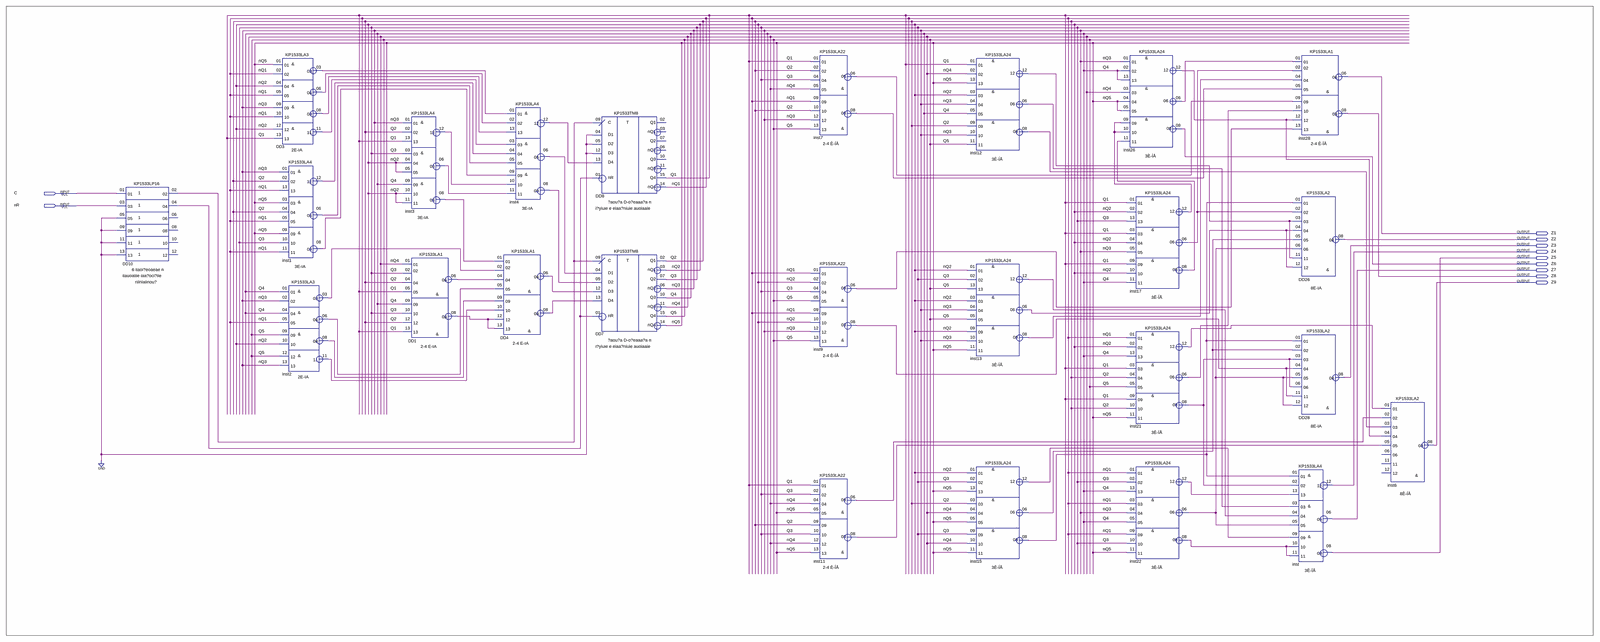
[diagram p0: schematic sheet, whole]
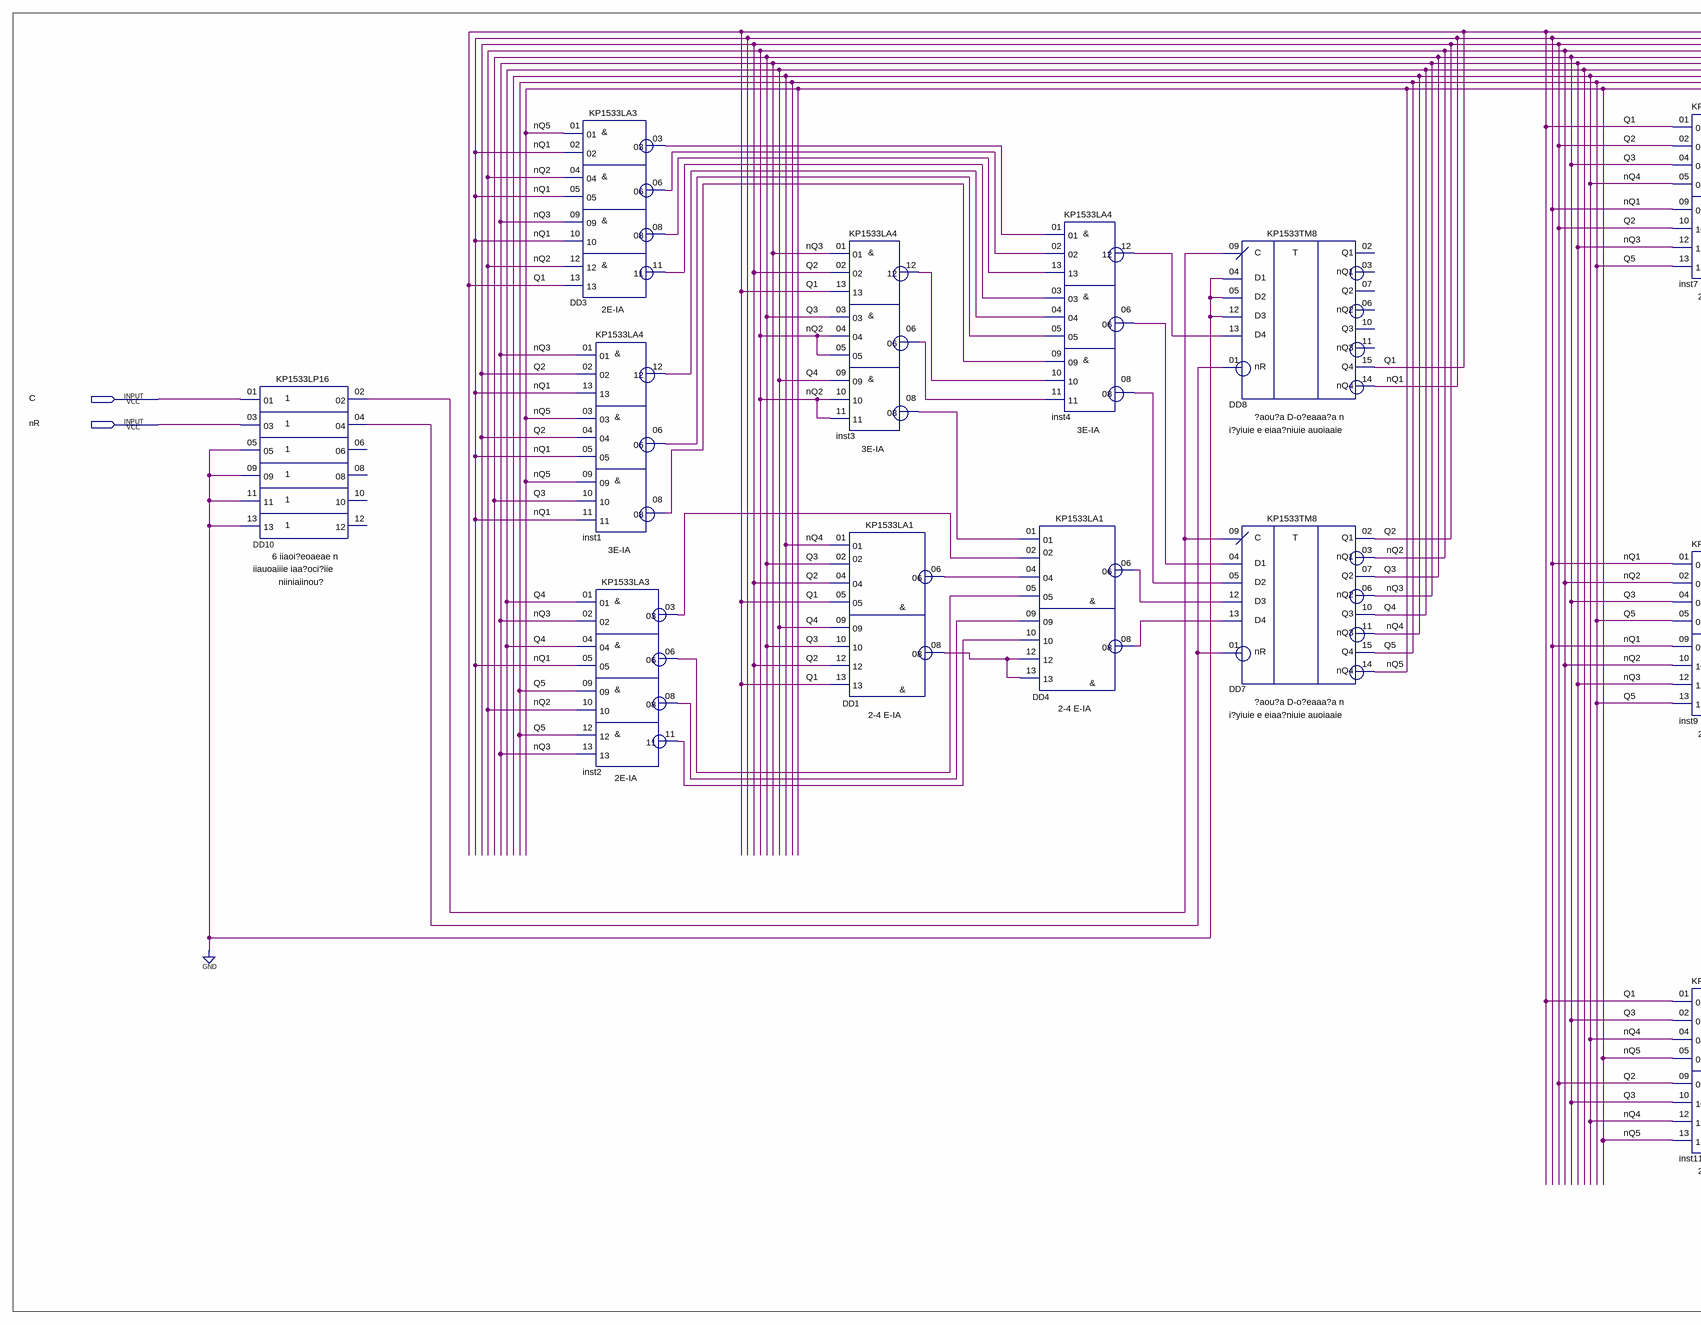
[diagram p1: schematic sheet, left part]
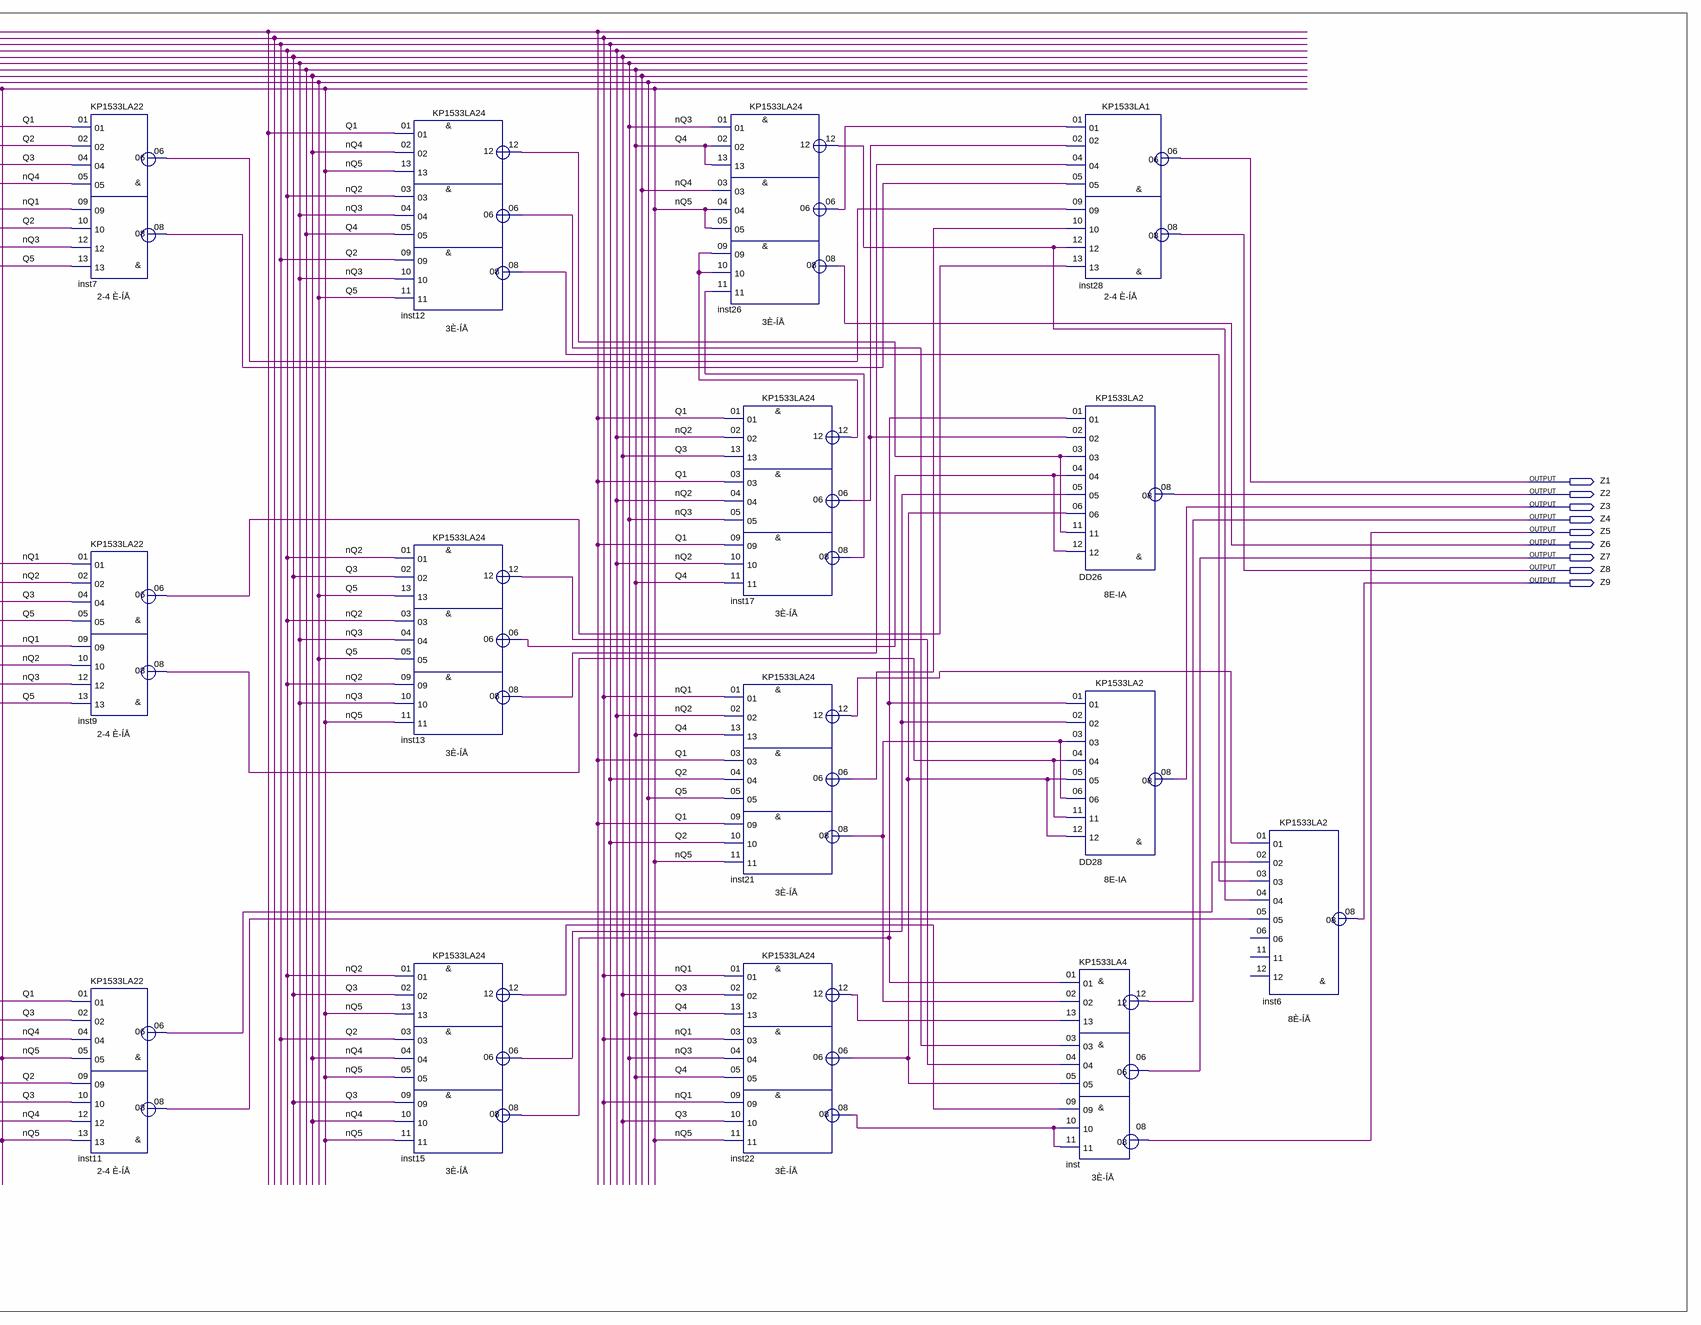
[diagram p2: schematic sheet, right part]
// Quartus schematic _GN_BC_DFF_PK_NAND.bdf as structural Verilog: 25 symbols, 11 pins
module _GN_BC_DFF_PK_NAND (
  input  C,
  input  nR,
  output Z1,
  output Z2,
  output Z3,
  output Z4,
  output Z5,
  output Z6,
  output Z7,
  output Z8,
  output Z9
);

  wire DD1_06, DD1_08, DD3_03, DD3_06, DD3_08, DD3_11, DD4_06, DD4_08, DD10_02, DD10_04, inst1_06, inst1_08,
       inst1_12, inst2_03, inst2_06, inst2_08, inst2_11, inst3_06, inst3_08, inst3_12, inst4_06, inst4_08,
       inst4_12, inst7_06, inst7_08, inst9_06, inst9_08, inst11_06, inst11_08, inst12_06, inst12_08,
       inst12_12, inst13_06, inst13_08, inst13_12, inst15_06, inst15_08, inst15_12, inst17_06, inst17_08,
       inst17_12, inst21_06, inst21_08, inst21_12, inst22_06, inst22_08, inst22_12, inst26_06, inst26_12,
       nQ1, nQ2, nQ3, nQ4, nQ5, Q1, Q2, Q3, Q4, Q5;

  KP1533LP16 DD10 (
    .\01 (C), .\03 (nR), .\05 (1'b0), .\09 (1'b0), .\11 (1'b0), .\13 (1'b0), .\02 (DD10_02), .\04 (DD10_04));  // open: 06, 08, 10, 12
  KP1533LA3 DD3 (
    .\01 (nQ5), .\02 (nQ1), .\04 (nQ2), .\05 (nQ1), .\09 (nQ3), .\10 (nQ1), .\12 (nQ2), .\13 (Q1),
    .\03 (DD3_03), .\06 (DD3_06), .\08 (DD3_08), .\11 (DD3_11));
  KP1533LA4 inst1 (
    .\01 (nQ3), .\02 (Q2), .\13 (nQ1), .\03 (nQ5), .\04 (Q2), .\05 (nQ1), .\09 (nQ5), .\10 (Q3), .\11 (nQ1),
    .\12 (inst1_12), .\06 (inst1_06), .\08 (inst1_08));
  KP1533LA3 inst2 (
    .\01 (Q4), .\02 (nQ3), .\04 (Q4), .\05 (nQ1), .\09 (Q5), .\10 (nQ2), .\12 (Q5), .\13 (nQ3),
    .\03 (inst2_03), .\06 (inst2_06), .\08 (inst2_08), .\11 (inst2_11));
  KP1533LA4 inst3 (
    .\01 (nQ3), .\02 (Q2), .\13 (Q1), .\03 (Q3), .\04 (nQ2), .\05 (nQ2), .\09 (Q4), .\10 (nQ2), .\11 (nQ2),
    .\12 (inst3_12), .\06 (inst3_06), .\08 (inst3_08));
  KP1533LA1 DD1 (
    .\01 (nQ4), .\02 (Q3), .\04 (Q2), .\05 (Q1), .\09 (Q4), .\10 (Q3), .\12 (Q2), .\13 (Q1), .\06 (DD1_06),
    .\08 (DD1_08));
  KP1533LA4 inst4 (
    .\01 (DD3_03), .\02 (DD3_06), .\13 (DD3_08), .\03 (DD3_11), .\04 (inst1_12), .\05 (inst1_06),
    .\09 (inst1_08), .\10 (inst3_12), .\11 (inst3_06), .\12 (inst4_12), .\06 (inst4_06), .\08 (inst4_08));
  KP1533LA1 DD4 (
    .\01 (inst3_08), .\02 (inst2_03), .\04 (DD1_06), .\05 (inst2_06), .\09 (inst2_08), .\10 (inst2_11),
    .\12 (DD1_08), .\13 (DD1_08), .\06 (DD4_06), .\08 (DD4_08));
  KP1533TM8 DD8 (
    .nR(DD10_04), .C(DD10_02), .D1(1'b0), .D2(1'b0), .D3(1'b0), .D4(inst4_12), .Q4(Q1), .nQ4(nQ1));  // open: Q1, nQ1, Q2, nQ2, Q3, nQ3
  KP1533TM8 DD7 (
    .nR(DD10_04), .C(DD10_02), .D1(inst4_06), .D2(inst4_08), .D3(DD4_06), .D4(DD4_08), .Q1(Q2), .nQ1(nQ2),
    .Q2(Q3), .nQ2(nQ3), .Q3(Q4), .nQ3(nQ4), .Q4(Q5), .nQ4(nQ5));
  KP1533LA22 inst7 (
    .\01 (Q1), .\02 (Q2), .\04 (Q3), .\05 (nQ4), .\09 (nQ1), .\10 (Q2), .\12 (nQ3), .\13 (Q5),
    .\06 (inst7_06), .\08 (inst7_08));
  KP1533LA22 inst9 (
    .\01 (nQ1), .\02 (nQ2), .\04 (Q3), .\05 (Q5), .\09 (nQ1), .\10 (nQ2), .\12 (nQ3), .\13 (Q5),
    .\06 (inst9_06), .\08 (inst9_08));
  KP1533LA22 inst11 (
    .\01 (Q1), .\02 (Q3), .\04 (nQ4), .\05 (nQ5), .\09 (Q2), .\10 (Q3), .\12 (nQ4), .\13 (nQ5),
    .\06 (inst11_06), .\08 (inst11_08));
  KP1533LA24 inst12 (
    .\01 (Q1), .\02 (nQ4), .\13 (nQ5), .\03 (nQ2), .\04 (nQ3), .\05 (Q4), .\09 (Q2), .\10 (nQ3), .\11 (Q5),
    .\12 (inst12_12), .\06 (inst12_06), .\08 (inst12_08));
  KP1533LA24 inst13 (
    .\01 (nQ2), .\02 (Q3), .\13 (Q5), .\03 (nQ2), .\04 (nQ3), .\05 (Q5), .\09 (nQ2), .\10 (nQ3), .\11 (nQ5),
    .\12 (inst13_12), .\06 (inst13_06), .\08 (inst13_08));
  KP1533LA24 inst15 (
    .\01 (nQ2), .\02 (Q3), .\13 (nQ5), .\03 (Q2), .\04 (nQ4), .\05 (nQ5), .\09 (Q3), .\10 (nQ4), .\11 (nQ5),
    .\12 (inst15_12), .\06 (inst15_06), .\08 (inst15_08));
  KP1533LA24 inst26 (
    .\01 (nQ3), .\02 (Q4), .\13 (Q4), .\03 (nQ4), .\04 (nQ5), .\05 (nQ5), .\09 (inst17_12), .\10 (inst17_12),
    .\11 (inst17_08), .\12 (inst26_12), .\06 (inst26_06), .\08 (Z6));
  KP1533LA24 inst17 (
    .\01 (Q1), .\02 (nQ2), .\13 (Q3), .\03 (Q1), .\04 (nQ2), .\05 (nQ3), .\09 (Q1), .\10 (nQ2), .\11 (Q4),
    .\12 (inst17_12), .\06 (inst17_06), .\08 (inst17_08));
  KP1533LA24 inst21 (
    .\01 (nQ1), .\02 (nQ2), .\13 (Q4), .\03 (Q1), .\04 (Q2), .\05 (Q5), .\09 (Q1), .\10 (Q2), .\11 (nQ5),
    .\12 (inst21_12), .\06 (inst21_06), .\08 (inst21_08));
  KP1533LA24 inst22 (
    .\01 (nQ1), .\02 (Q3), .\13 (Q4), .\03 (nQ1), .\04 (nQ3), .\05 (Q4), .\09 (nQ1), .\10 (Q3), .\11 (nQ5),
    .\12 (inst22_12), .\06 (inst22_06), .\08 (inst22_08));
  KP1533LA1 inst28 (
    .\01 (inst26_06), .\02 (inst17_06), .\04 (inst13_08), .\05 (inst7_08), .\09 (inst7_06), .\10 (inst21_06),
    .\12 (inst26_12), .\13 (inst9_06), .\06 (Z1), .\08 (Z8));
  KP1533LA2 DD26 (
    .\01 (inst15_08), .\02 (inst17_06), .\03 (inst12_12), .\04 (inst13_06), .\05 (inst15_06),
    .\06 (inst22_06), .\11 (inst12_12), .\12 (inst13_06), .\08 (Z2));
  KP1533LA2 DD28 (
    .\01 (inst15_08), .\02 (inst15_06), .\03 (inst21_08), .\04 (inst9_08), .\05 (inst22_06),
    .\06 (inst21_08), .\11 (inst9_08), .\12 (inst22_06), .\08 (Z3));
  KP1533LA4 inst (
    .\01 (inst15_08), .\02 (inst21_08), .\13 (inst22_12), .\03 (inst12_06), .\04 (inst13_12),
    .\05 (inst22_06), .\09 (inst15_12), .\10 (inst22_08), .\11 (inst22_08), .\12 (Z4), .\06 (Z7), .\08 (Z5));
  KP1533LA2 inst6 (
    .\01 (inst21_12), .\02 (inst11_06), .\03 (inst12_08), .\04 (inst26_12), .\05 (inst11_08), .\08 (Z9));  // open: 06, 11, 12
endmodule
